# EAGLE schematic SensorBoard_a0.2 (EAGLE 6.4)
Powermon v alpha0.2
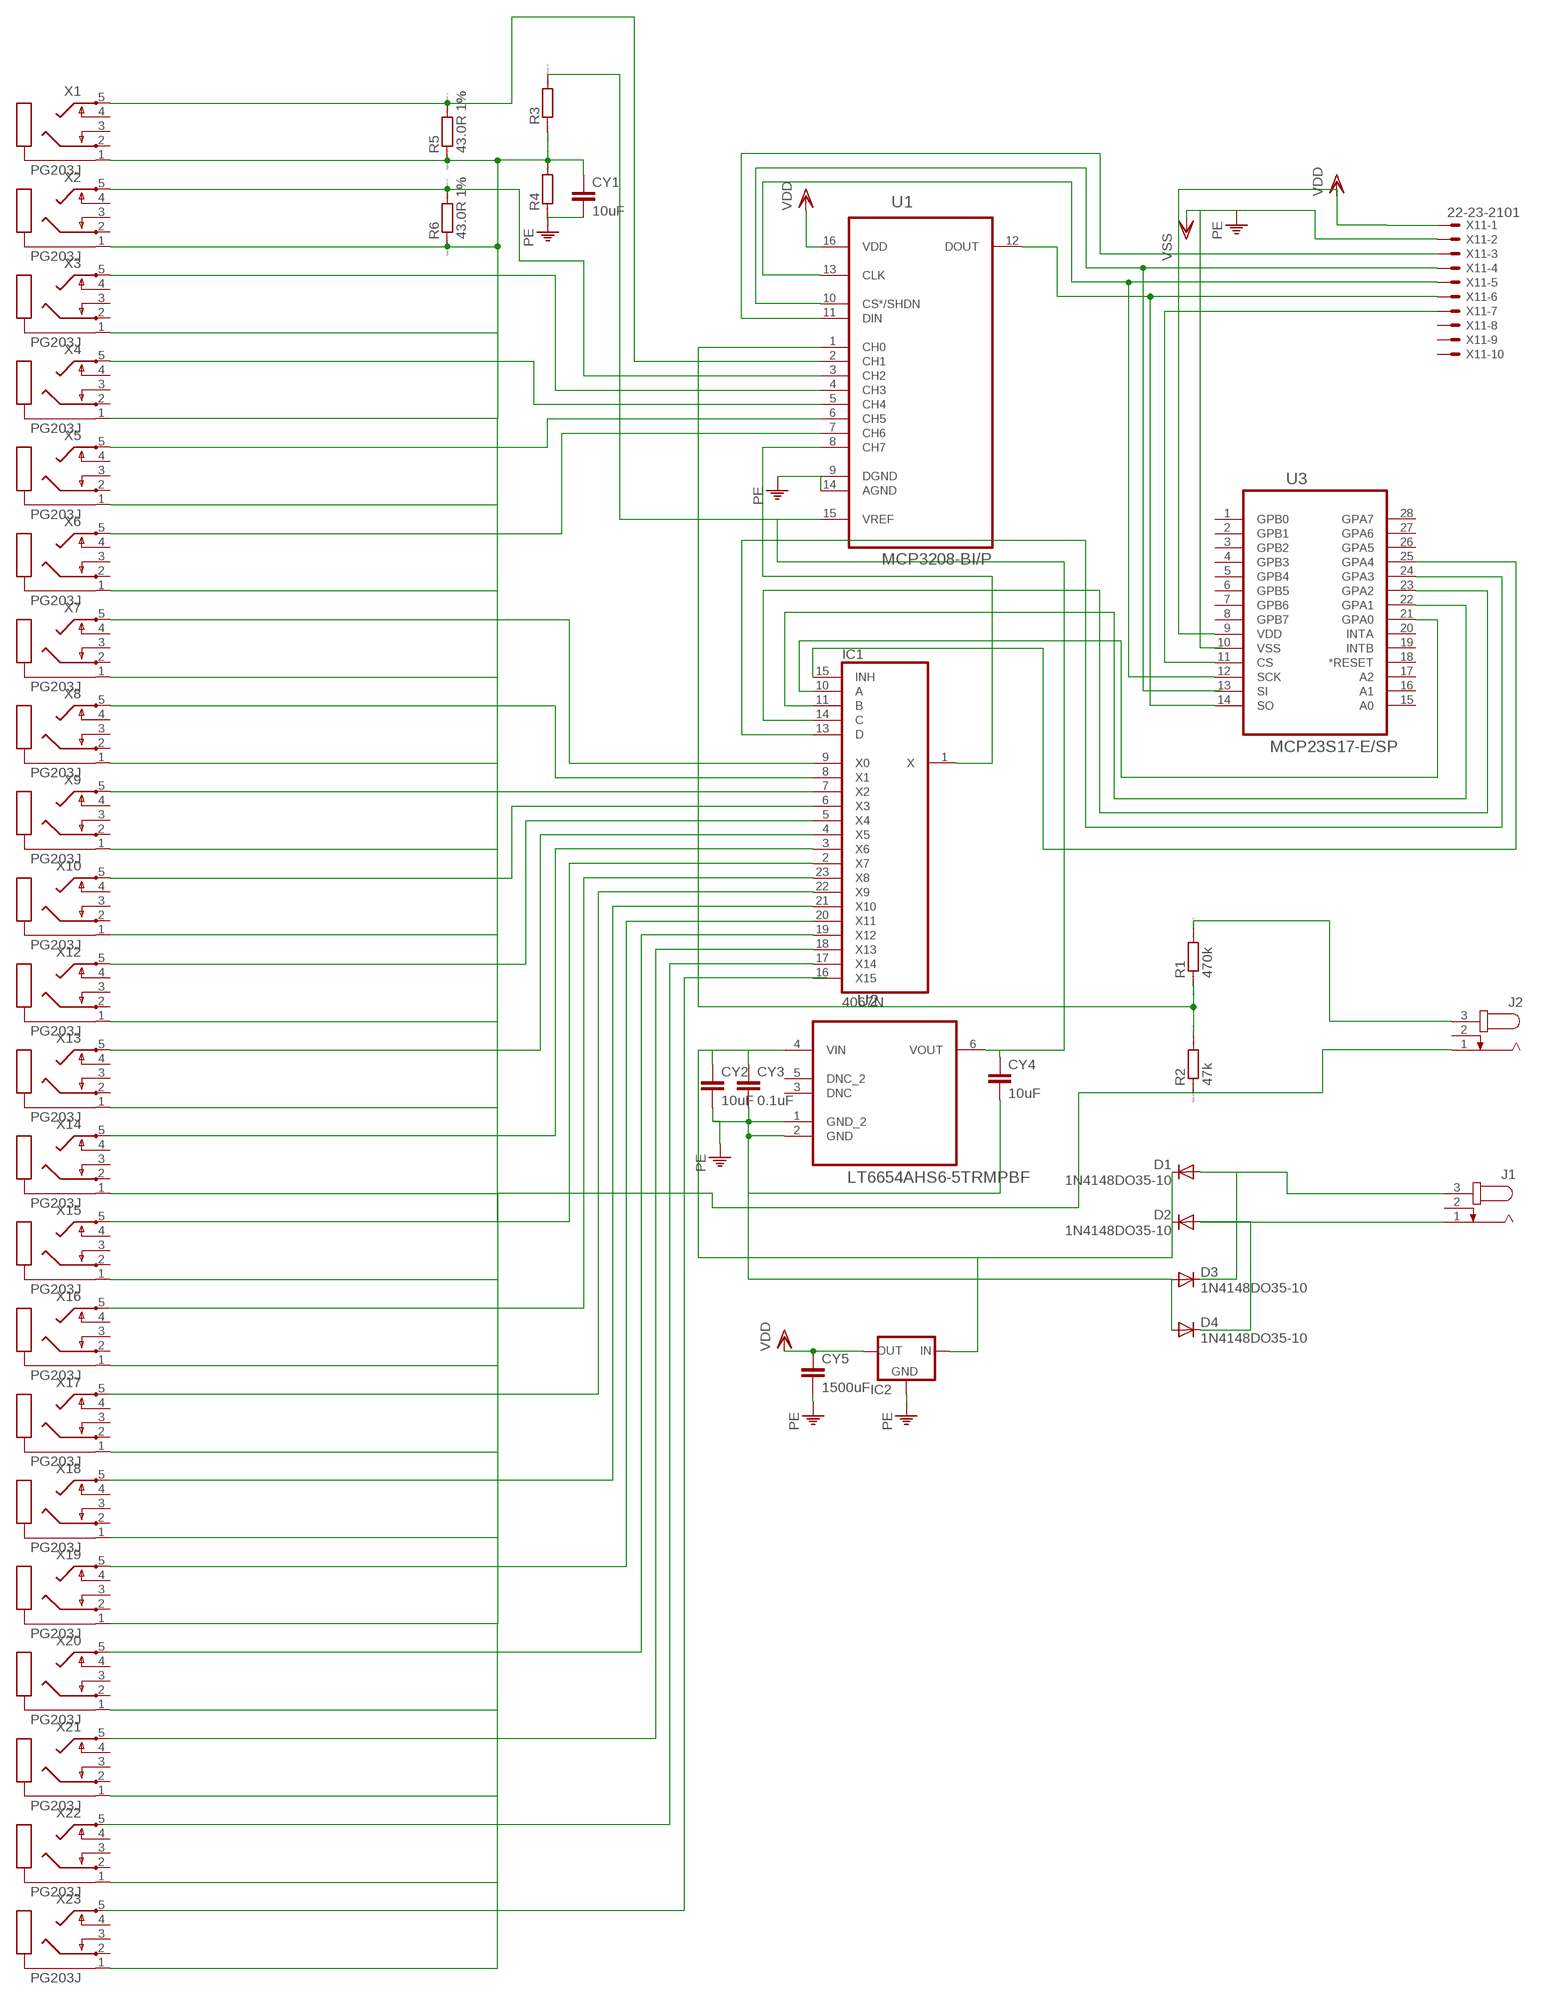
[diagram p0: schematic, sheet 1]

## Parts
CY1  10uF  CYYC10B5  [YC10B5]
CY2  10uF  CYYC10B5  [YC10B5]
CY3  0.1uF  CYYC10B5  [YC10B5]
CY4  10uF  CYYC10B5  [YC10B5]
CY5  1500uF  CYYC10B5  [YC10B5]
D1  1N4148DO35-10  [DO35-10]
D2  1N4148DO35-10  [DO35-10]
D3  1N4148DO35-10  [DO35-10]
D4  1N4148DO35-10  [DO35-10]
IC1  4067N  [DIL24-6]
IC2  V_REG_78XXSIDE  [78XXL]
J1  JACK-PLUG1  [SPC4078]
J2  JACK-PLUG1  [SPC4078]
R1  470k  R0207/10  [0207/10]
R2  47k  R0207/10  [0207/10]
R3  R0207/10  [0207/10]
R4  R0207/10  [0207/10]
R5  43.0R 1%  R0207/10  [0207/10]
R6  43.0R 1%  R0207/10  [0207/10]
U1  MCP3208-BI/P  [DIP254P762X533-16]
U2  LT6654AHS6-5TRMPBF  [SOT95P280X100-6N]
U3  MCP23S17-E/SP  [DIP254P762X406-28P]
X1  PG203J  [PG203J]
X2  PG203J  [PG203J]
X3  PG203J  [PG203J]
X4  PG203J  [PG203J]
X5  PG203J  [PG203J]
X6  PG203J  [PG203J]
X7  PG203J  [PG203J]
X8  PG203J  [PG203J]
X9  PG203J  [PG203J]
X10  PG203J  [PG203J]
X11  22-23-2101  [22-23-2101]
X12  PG203J  [PG203J]
X13  PG203J  [PG203J]
X14  PG203J  [PG203J]
X15  PG203J  [PG203J]
X16  PG203J  [PG203J]
X17  PG203J  [PG203J]
X18  PG203J  [PG203J]
X19  PG203J  [PG203J]
X20  PG203J  [PG203J]
X21  PG203J  [PG203J]
X22  PG203J  [PG203J]
X23  PG203J  [PG203J]

## Nets
N$1: CY4.1 R3.2 U1.15(VREF) U2.6(VOUT)
N$2: CY1.1 J2.1 R2.1 R3.1 R4.2 R5.1 R6.1 X1.1 X2.1 X3.1 X4.1 X5.1 X6.1 X7.1 X8.1 X9.1 X10.1 X12.1 X13.1 X14.1 X15.1 X16.1 X17.1 X18.1 X19.1 X20.1 X21.1 X22.1 X23.1
N$3: IC1.1(X) U1.8(CH7)
N$4: CY2.1 CY3.1 D1.C D2.C IC2.IN U2.4(VIN)
N$7: IC1.20(X11) X19.5
N$8: R1.1 R2.2 U1.1(CH0)
N$9: U1.12(DOUT) U3.14(SO) X11.6
N$10: U1.13(CLK) U3.12(SCK) X11.5
N$11: U1.10(CS*/SHDN) X11.4
N$12: X11.3
N$13: U1.11(DIN)
N$14: IC1.10(A) U3.21(GPA0)
N$15: R6.2 U1.3(CH2) X2.5
N$16: R5.2 U1.2(CH1) X1.5
N$17: U1.4(CH3) X3.5
N$18: U1.5(CH4) X4.5
N$19: U1.6(CH5) X5.5
N$20: U1.7(CH6) X6.5
N$21: IC1.9(X0) X7.5
N$22: IC1.8(X1) X8.5
N$23: IC1.7(X2) X9.5
N$24: IC1.6(X3) X10.5
N$25: IC1.11(B) U3.22(GPA1)
N$26: IC1.14(C) U3.23(GPA2)
N$27: IC1.13(D) U3.24(GPA3)
N$28: IC1.15(INH) U3.25(GPA4)
N$29: D1.A D3.C J1.3
N$30: J2.3 R1.2
N$31: U3.11(CS) X11.7
N$32: D2.A D4.C J1.1
N$33: IC1.5(X4) X12.5
N$34: IC1.4(X5) X13.5
N$35: IC1.3(X6) X14.5
N$36: IC1.2(X7) X15.5
N$37: IC1.23(X8) X16.5
N$38: IC1.22(X9) X17.5
N$39: IC1.21(X10) X18.5
N$40: IC1.19(X12) X20.5
N$41: IC1.18(X13) X21.5
N$42: IC1.17(X14) X22.5
N$43: IC1.16(X15) X23.5
PE: CY1.2 CY2.2 CY3.2 CY4.2 CY5.2 D3.A D4.A IC2.GND R4.1 U1.9(DGND) U1.14(AGND) U2.1(GND_2) U2.2(GND) X11.2 ; supply symbol labelled VSS
VDD: CY5.1 IC2.OUT U1.16(VDD) U3.9(VDD) X11.1
Unconnected: J1.2 J2.2 U2.3(DNC) U2.5(DNC_2) U3.1(GPB0) U3.2(GPB1) U3.3(GPB2) U3.4(GPB3) U3.5(GPB4) U3.6(GPB5) U3.7(GPB6) U3.8(GPB7) U3.13(SI) U3.15(A0) U3.16(A1) U3.17(A2) U3.18(*RESET) U3.19(INTB) U3.20(INTA) U3.26(GPA5) U3.27(GPA6) U3.28(GPA7) X1.2 X1.3 X1.4 X2.2 X2.3 X2.4 X3.2 X3.3 X3.4 X4.2 X4.3 X4.4 X5.2 X5.3 X5.4 X6.2 X6.3 X6.4 X7.2 X7.3 X7.4 X8.2 X8.3 X8.4 X9.2 X9.3 X9.4 X10.2 X10.3 X10.4 X11.8 X11.9 X11.10 X12.2 X12.3 X12.4 X13.2 X13.3 X13.4 X14.2 X14.3 X14.4 X15.2 X15.3 X15.4 X16.2 X16.3 X16.4 X17.2 X17.3 X17.4 X18.2 X18.3 X18.4 X19.2 X19.3 X19.4 X20.2 X20.3 X20.4 X21.2 X21.3 X21.4 X22.2 X22.3 X22.4 X23.2 X23.3 X23.4

## Power pins joined to a net without a drawn wire
VDD: IC1.24(VDD)
VSS: IC1.12(VSS) U3.10(VSS)

## Library data of the parts
CY1-CY5 = rcl:CY: Y CAPACITOR for power line
D1-D4 = diode:1N4148: DIODE high speed (Philips)
IC1 = 40xx:4067: 16-channel ANALOG MULTIPLEXER
IC2 = SparkFun-PowerIC:V_REG_78XX: Voltage Regulator Standard 7805 5V regulator. IGO (Input Ground Output). Spark Fun Electronics SKU : COM-00107
J1 J2 = con-jack:JACK-PLUG: DC POWER JACK Power Jack, DC, Right Angle, Through Hole, Rated 5A at 16VDC, PC Terminals Distributor: Farnell (www.Farnell.de) Drawing: 84N1161.pdf / 84N1162.pdf Manufacturer: SPC Technology (www.spctechnology.com) Type: SPC4077 / SPC 4078; OC_FARNELL: unknown; OC_NEWARK: unknown
R1-R6 = eagle-ltspice:R: RESISTOR, European symbol; SPICEMODEL: NONE; SPICEPREFIX: R
U1 = mcp3208v2:MCP3208-BI/P: IC, ADC, 12BIT, 100kSPS, SERIAL, SPI, DIP-16; MPN: MCP3208-BI/P; OC_FARNELL: 1863934; OC_NEWARK: 23C2842; PACKAGE: DIP-16; SUPPLIER: Microchip
U2 = lt6656bcs6:LT6654AHS6-5TRMPBF: Precision Wide Supply High Output Drive Low Noise Reference; MPN: LT6654AHS6-5#TRMPBF; OC_FARNELL: 1924973; OC_NEWARK: 24T2765; PACKAGE: TSOT-23-6; SUPPLIER: Linear Technology
U3 = MCP23x17:MCP23S17-E/SP: IC, 16-Bit I/O Expander with Serial Interface, DIP-28; MPN: MCP23S17-E/SP; OC_FARNELL: 1292238; OC_NEWARK: 31K2951; PACKAGE: DIP-28; SUPPLIER: Microchip
X1-X10 X12-X23 = con-hirschmann:PG203J: MIC/HEADPHONE JACK KS-S stereo microphone/headphone jack PG203JN (Schukat); OC_FARNELL: unknown; OC_NEWARK: unknown
X11 = con-molex:22-23-2101: .100" (2.54mm) Center Header - 10 Pin; MF: MOLEX; MPN: 22-23-2101; OC_FARNELL: 1756828; OC_NEWARK: 94C0765